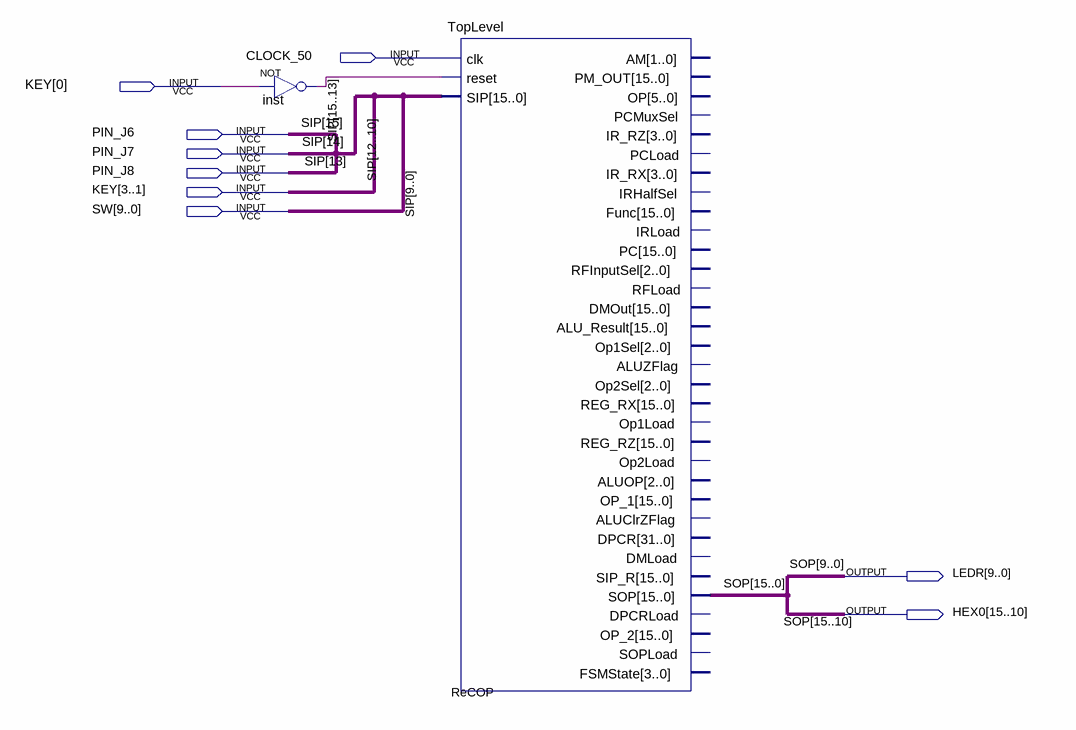
[diagram p0: schematic sheet]
// Quartus schematic ReCOP.bdf as structural Verilog: 2 symbols, 9 pins
module ReCOP (
  input  CLOCK_50,
  input  [3:0] KEY,
  input  PIN_J6,
  input  PIN_J7,
  input  PIN_J8,
  input  [9:0] SW,
  output [9:0] LEDR,
  output [15:10] HEX0
);

  wire inst_out;

  not inst (inst_out, KEY[0]);
  TopLevel ReCOP (
    .clk(CLOCK_50), .reset(inst_out), .SIP({PIN_J6, PIN_J7, PIN_J8, KEY[3:1], SW}), .SOP({HEX0, LEDR}));  // open: AM, PM_OUT, OP, PCMuxSel, IR_RZ, PCLoad, IR_RX, IRHalfSel, Func, IRLoad, PC, RFInputSel, RFLoad, DMOut, ALU_Result, Op1Sel, ALUZFlag, Op2Sel, REG_RX, Op1Load, REG_RZ, Op2Load, ALUOP, OP_1, ALUClrZFlag, DPCR, DMLoad, SIP_R, DPCRLoad, OP_2, SOPLoad, FSMState

  // Other names for the same wires on the sheet: SIP[15:0] = {PIN_J6, PIN_J7, PIN_J8, KEY[3:1], SW};
  //   SOP[15:0] = {HEX0, LEDR}
endmodule
